# EAGLE design SA_v2a (EAGLE 7.5.0)
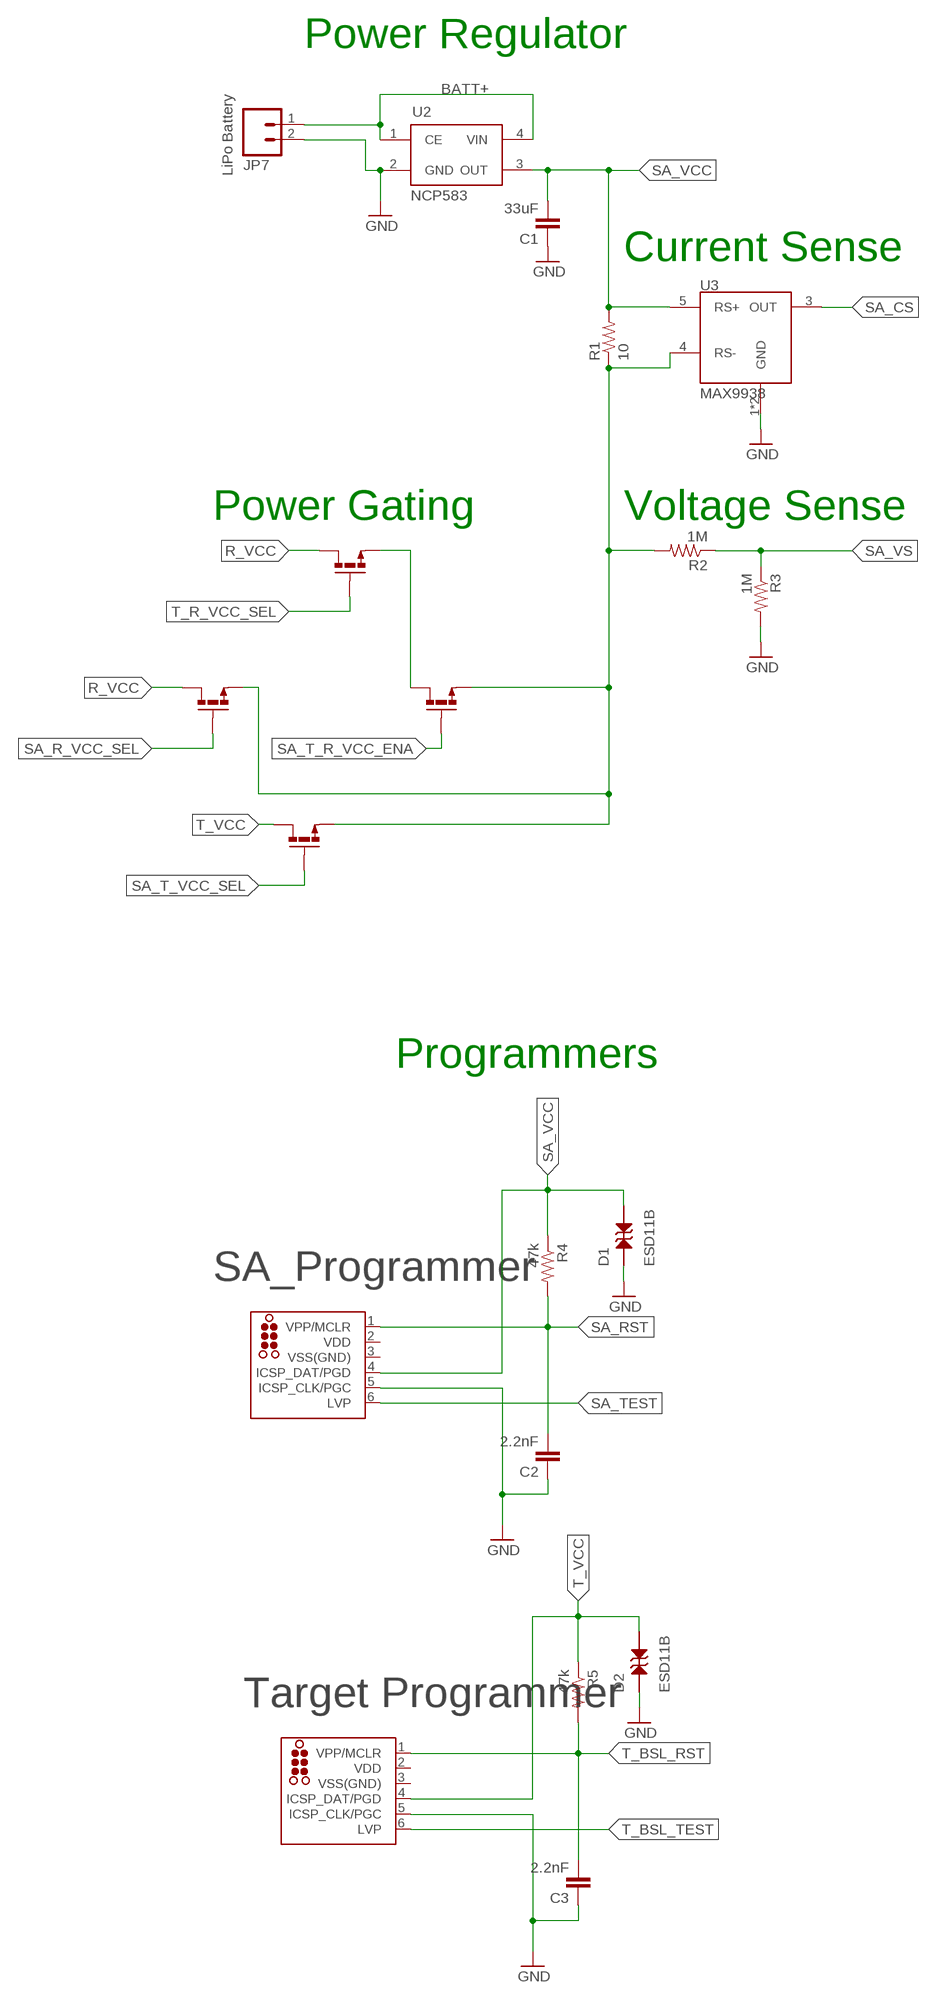
[diagram p0: schematic, sheet 1, part 1 of 2]
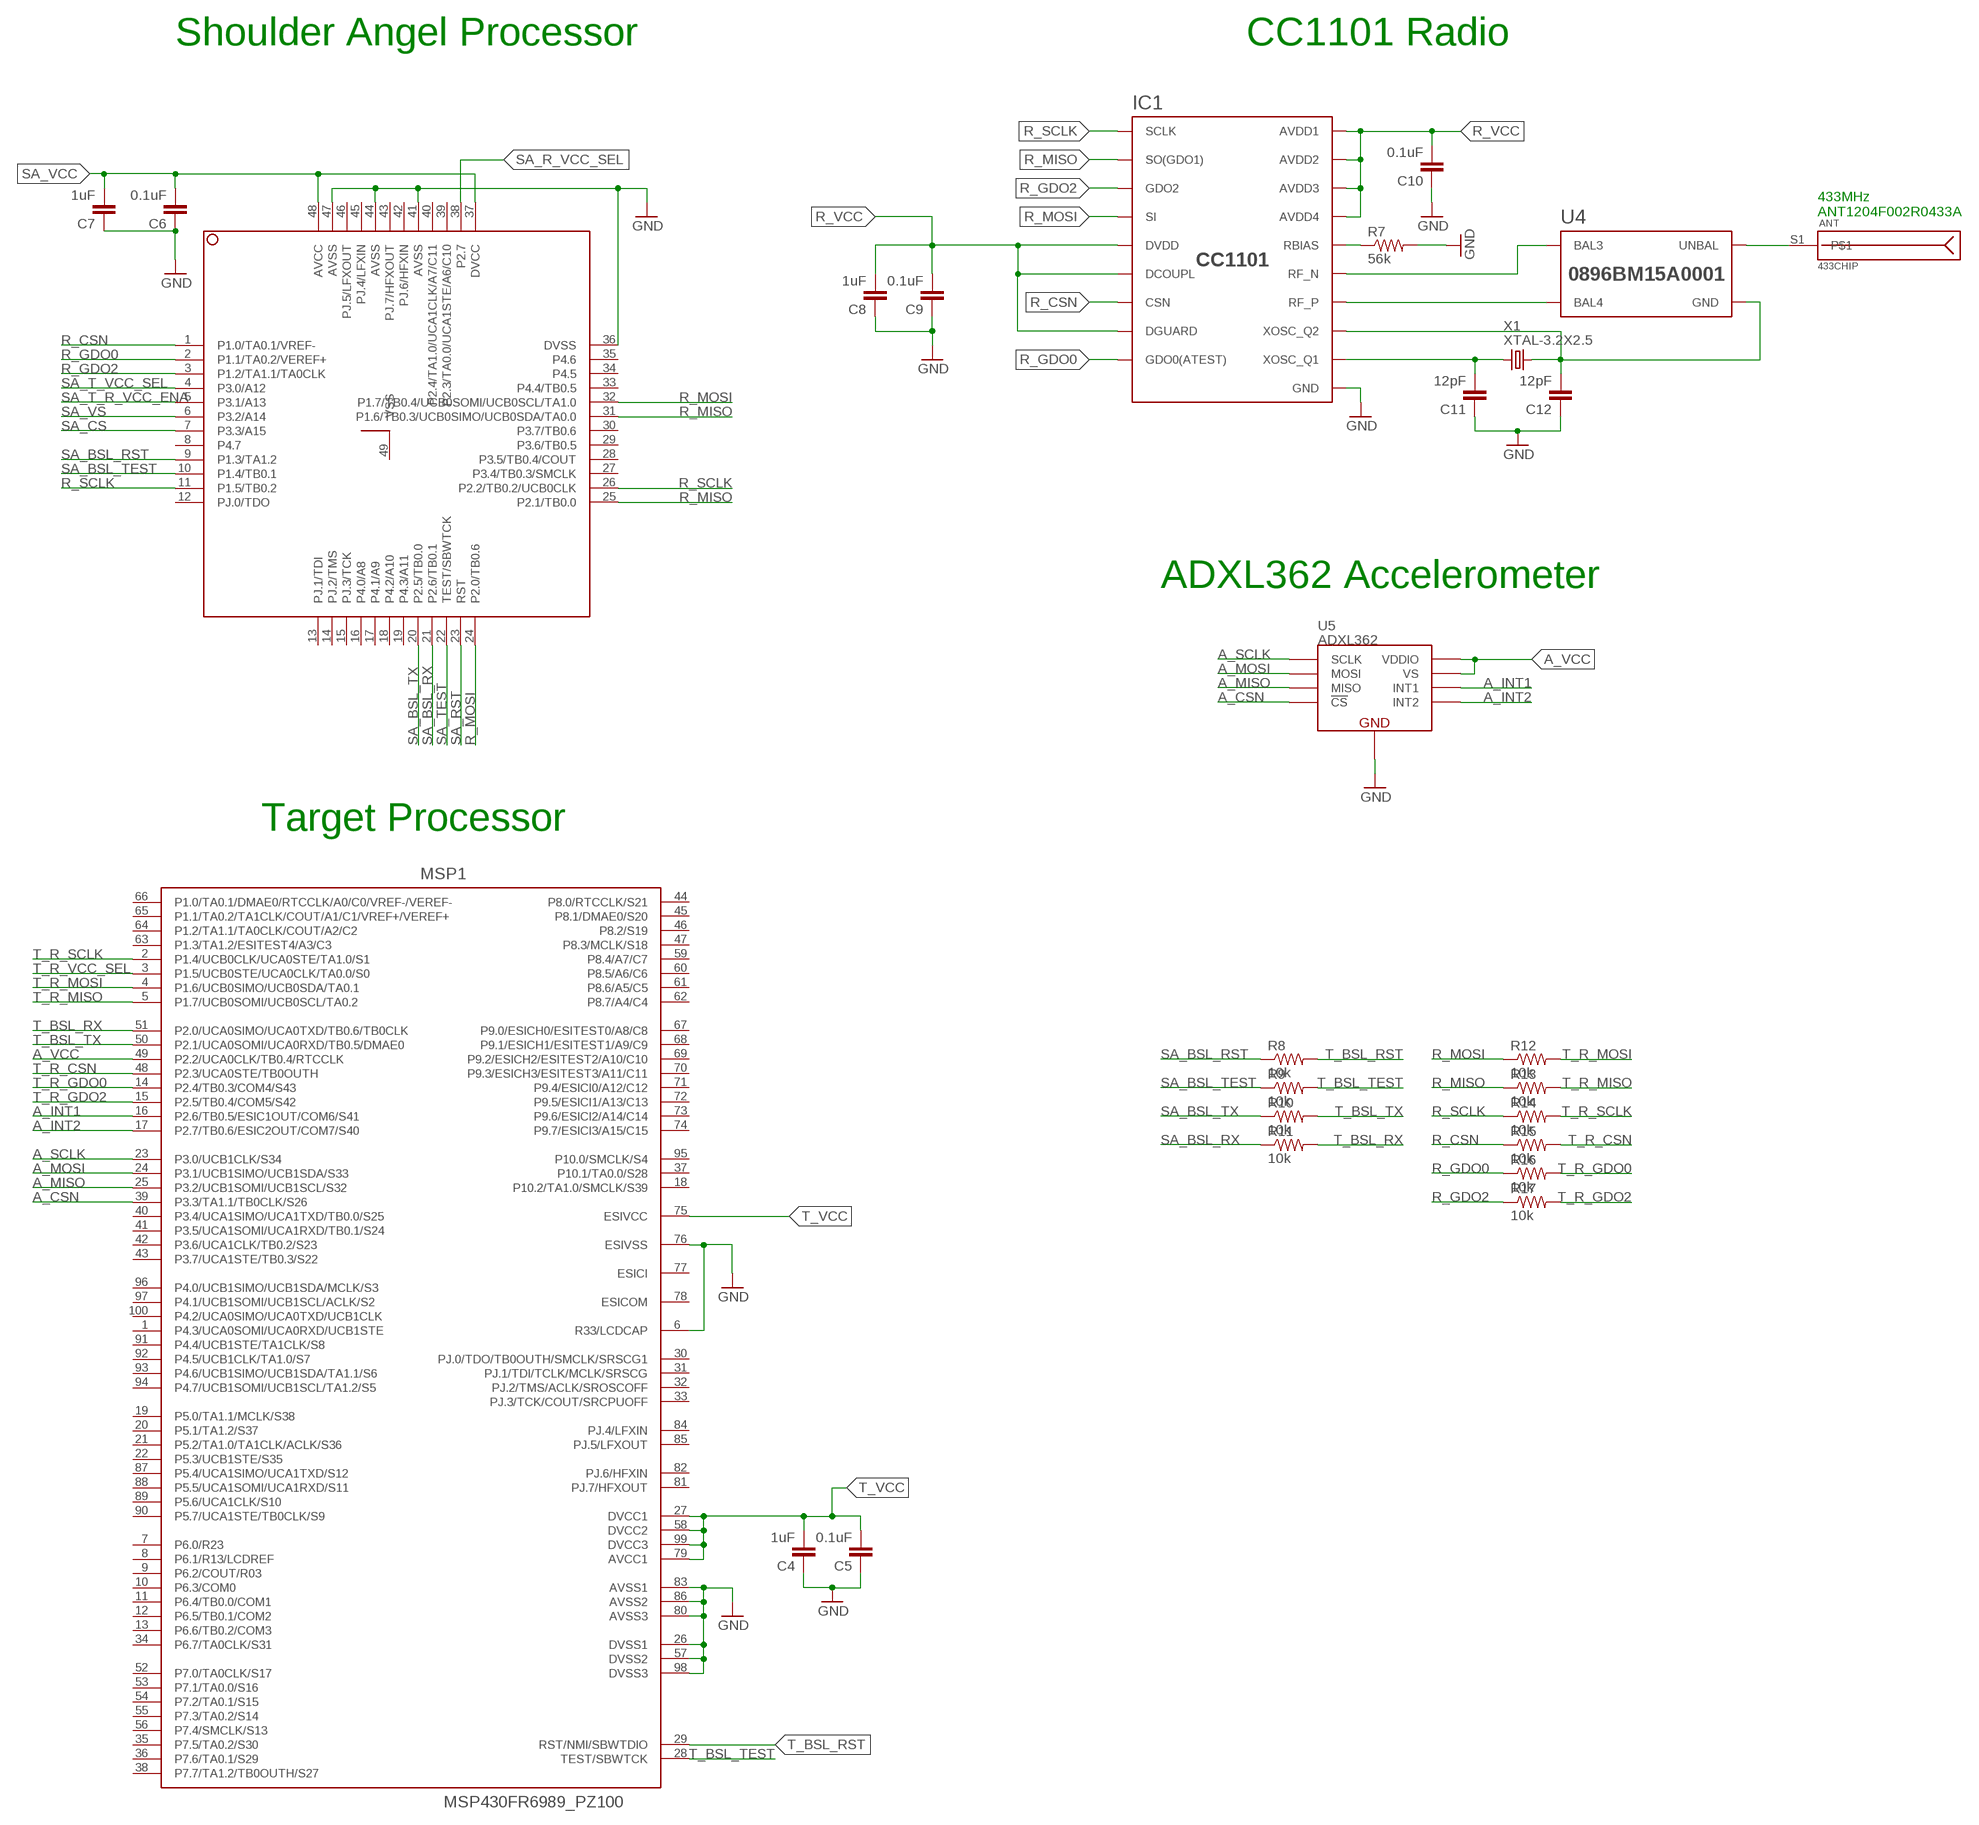
[diagram p1: schematic, sheet 1, part 2 of 2]

## Parts
ANT  433CHIP  [ANT-433-USP]
C1  33uF  CAP0805  [0805]
C2  2.2nF  C-EU  [0402]
C3  2.2nF  C-EU  [0402]
C4  1uF  C-EU  [0402]
C5  0.1uF  C-EU  [0402]
C6  0.1uF  C-EU  [0402]
C7  1uF  C-EU  [0402]
C8  1uF  C-EU  [0402]
C9  0.1uF  C-EU  [0402]
C10  0.1uF  C-EU  [0402]
C11  12pF  C-EU  [0402]
C12  12pF  C-EU  [0402]
D1  ESD11B  [DSN2]
D2  ESD11B  [DSN2]
IC1  CC1101  [QLP20]
J1  TC2030-MCP-NL  [TC2030-MCP-NL]
J2  TC2030-MCP-NL  [TC2030-MCP-NL]
JP7  LiPo Battery  M02-JST-2MM-SMT  [JST-2-SMD]
MSP1  MSP430FR6989_PZ100  [PZ100]
R1  10  R-EU  [0402]
R2  1M  R-EU  [0402]
R3  1M  R-EU  [0402]
R4  47k  R-EU  [0402]
R5  47k  R-EU  [0402]
R7  56k  R-EU  [0402]
R8  10k  R-EU  [0402]
R9  10k  R-EU  [0402]
R10  10k  R-EU  [0402]
R11  10k  R-EU  [0402]
R12  10k  R-EU  [0402]
R13  10k  R-EU  [0402]
R14  10k  R-EU  [0402]
R15  10k  R-EU  [0402]
R16  10k  R-EU  [0402]
R17  10k  R-EU  [0402]
U1  MSP430FR5969_RGZ_48  [RGZ48_4P1X4P1]
U2  NCP583  [SC82-AB_1PRIMARY]
U3  MAX9938  [SOT23-5]
U4  0896BM15A0001  [XXXXBM15A0001]
U5  ADXL362  [ADXL362]
U$1  FDG6303N  [SC70-6]
U$2  FDG6303N  [SC70-6]
X1  XTAL-3.2X2.5  [XTAL-3.2X2.5]

## Nets
A_CSN: MSP1.39(P3.3/TA1.1/TB0CLK/S26) U5.P$8(!CS)
A_INT1: MSP1.16(P2.6/TB0.5/ESIC1OUT/COM6/S41) U5.P$11(INT1)
A_INT2: MSP1.17(P2.7/TB0.6/ESIC2OUT/COM7/S40) U5.P$9(INT2)
A_MISO: MSP1.25(P3.2/UCB1SOMI/UCB1SCL/S32) U5.P$7(MISO)
A_MOSI: MSP1.24(P3.1/UCB1SIMO/UCB1SDA/S33) U5.P$6(MOSI)
A_SCLK: MSP1.23(P3.0/UCB1CLK/S34) U5.P$4(SCLK)
A_VCC: MSP1.49(P2.2/UCA0CLK/TB0.4/RTCCLK) U5.P$1(VDDIO) U5.P$14(VS)
BATT+: JP7.1 U2.1(CE) U2.4(VIN)
GND: C1.1 C2.1 C3.1 C4.1 C5.1 C6.1 C7.1 C8.1 C9.1 C10.1 C11.1 C12.1 D1.P$1 D2.P$1 IC1.16(GND) IC1.19(GND) IC1.GND IC1.GND1(GND) IC1.GND2(GND) IC1.GND3(GND) IC1.GND4(GND) IC1.GND5(GND) J1.5(ICSP_CLK/PGC) J2.5(ICSP_CLK/PGC) JP7.2 MSP1.6(R33/LCDCAP) MSP1.26(DVSS1) MSP1.57(DVSS2) MSP1.76(ESIVSS) MSP1.80(AVSS3) MSP1.83(AVSS1) MSP1.86(AVSS2) MSP1.98(DVSS3) R3.2 R7.2 U1.36(DVSS) U1.41(AVSS) U1.44(AVSS) U1.47(AVSS) U2.2(GND) U3.1(GND) U3.2(GND) U5.P$12(GND) U5.P$13(GND) U5.P$16(GND)
N$1: IC1.17(RBIAS) R7.1
N$2: IC1.12(RF_P) U4.4(BAL4)
N$3: R1.1 R2.2 U3.4(RS-) U$1.4(S1) U$2.1(S2) U$2.4(S1)
N$4: U$1.1(S2) U$1.3(D1)
N$5: IC1.13(RF_N) U4.3(BAL3)
N$6: C12.2 IC1.10(XOSC_Q2) U4.2(GND) U4.5(GND) U4.6(GND) X1.3
N$7: C11.2 IC1.8(XOSC_Q1) X1.1
N$9: ANT.S1 U4.1(UNBAL)
R_CSN: IC1.7(CSN) R15.1 U1.1(P1.0/TA0.1/VREF-)
R_GDO0: IC1.6(GDO0(ATEST)) R16.1 U1.2(P1.1/TA0.2/VEREF+)
R_GDO2: IC1.3(GDO2) R17.1 U1.3(P1.2/TA1.1/TA0CLK)
R_MISO: IC1.2(SO(GDO1)) R13.1 U1.25(P2.1/TB0.0) U1.31(P1.6/TB0.3/UCB0SIMO/UCB0SDA/TA0.0)
R_MOSI: IC1.20(SI) R12.1 U1.24(P2.0/TB0.6) U1.32(P1.7/TB0.4/UCB0SOMI/UCB0SCL/TA1.0)
R_SCLK: IC1.1(SCLK) R14.1 U1.11(P1.5/TB0.2) U1.26(P2.2/TB0.2/UCB0CLK)
R_VCC: C8.2 C9.2 C10.2 IC1.4(DVDD) IC1.5(DCOUPL) IC1.9(AVDD1) IC1.11(AVDD2) IC1.14(AVDD3) IC1.15(AVDD4) IC1.18(DGUARD) U$1.6(D2) U$2.6(D2)
SA_BSL_RST: R8.1 U1.9(P1.3/TA1.2)
SA_BSL_RX: R11.1 U1.21(P2.6/TB0.1)
SA_BSL_TEST: R9.1 U1.10(P1.4/TB0.1)
SA_BSL_TX: R10.1 U1.20(P2.5/TB0.0)
SA_CS: U1.7(P3.3/A15) U3.3(OUT)
SA_R_VCC_SEL: U1.38(P2.7) U$2.2(G2)
SA_RST: C2.2 J1.1(VPP/MCLR) R4.2 U1.23(RST)
SA_T_R_VCC_ENA: U1.5(P3.1/A13) U$1.5(G1)
SA_T_VCC_SEL: U1.4(P3.0/A12) U$2.5(G1)
SA_TEST: J1.6(LVP) U1.22(TEST/SBWTCK)
SA_VCC: C1.2 C6.2 C7.2 D1.P$2 J1.4(ICSP_DAT/PGD) R1.2 R4.1 U1.37(DVCC) U1.48(AVCC) U2.3(OUT) U3.5(RS+)
SA_VS: R2.1 R3.1 U1.6(P3.2/A14)
T_BSL_RST: C3.2 J2.1(VPP/MCLR) MSP1.29(RST/NMI/SBWTDIO) R5.2 R8.2
T_BSL_RX: MSP1.51(P2.0/UCA0SIMO/UCA0TXD/TB0.6/TB0CLK) R11.2
T_BSL_TEST: J2.6(LVP) MSP1.28(TEST/SBWTCK) R9.2
T_BSL_TX: MSP1.50(P2.1/UCA0SOMI/UCA0RXD/TB0.5/DMAE0) R10.2
T_R_CSN: MSP1.48(P2.3/UCA0STE/TB0OUTH) R15.2
T_R_GDO0: MSP1.14(P2.4/TB0.3/COM4/S43) R16.2
T_R_GDO2: MSP1.15(P2.5/TB0.4/COM5/S42) R17.2
T_R_MISO: MSP1.5(P1.7/UCB0SOMI/UCB0SCL/TA0.2) R13.2
T_R_MOSI: MSP1.4(P1.6/UCB0SIMO/UCB0SDA/TA0.1) R12.2
T_R_SCLK: MSP1.2(P1.4/UCB0CLK/UCA0STE/TA1.0/S1) R14.2
T_R_VCC_SEL: MSP1.3(P1.5/UCB0STE/UCA0CLK/TA0.0/S0) U$1.2(G2)
T_VCC: C4.2 C5.2 D2.P$2 J2.4(ICSP_DAT/PGD) MSP1.27(DVCC1) MSP1.58(DVCC2) MSP1.75(ESIVCC) MSP1.79(AVCC1) MSP1.99(DVCC3) R5.1 U$2.3(D1)
Unconnected: MSP1.1(P4.3/UCA0SOMI/UCA0RXD/UCB1STE) MSP1.7(P6.0/R23) MSP1.8(P6.1/R13/LCDREF) MSP1.9(P6.2/COUT/R03) MSP1.10(P6.3/COM0) MSP1.11(P6.4/TB0.0/COM1) MSP1.12(P6.5/TB0.1/COM2) MSP1.13(P6.6/TB0.2/COM3) MSP1.18(P10.2/TA1.0/SMCLK/S39) MSP1.19(P5.0/TA1.1/MCLK/S38) MSP1.20(P5.1/TA1.2/S37) MSP1.21(P5.2/TA1.0/TA1CLK/ACLK/S36) MSP1.22(P5.3/UCB1STE/S35) MSP1.30(PJ.0/TDO/TB0OUTH/SMCLK/SRSCG1) MSP1.31(PJ.1/TDI/TCLK/MCLK/SRSCG) MSP1.32(PJ.2/TMS/ACLK/SROSCOFF) MSP1.33(PJ.3/TCK/COUT/SRCPUOFF) MSP1.34(P6.7/TA0CLK/S31) MSP1.35(P7.5/TA0.2/S30) MSP1.36(P7.6/TA0.1/S29) MSP1.37(P10.1/TA0.0/S28) MSP1.38(P7.7/TA1.2/TB0OUTH/S27) MSP1.40(P3.4/UCA1SIMO/UCA1TXD/TB0.0/S25) MSP1.41(P3.5/UCA1SOMI/UCA1RXD/TB0.1/S24) MSP1.42(P3.6/UCA1CLK/TB0.2/S23) MSP1.43(P3.7/UCA1STE/TB0.3/S22) MSP1.44(P8.0/RTCCLK/S21) MSP1.45(P8.1/DMAE0/S20) MSP1.46(P8.2/S19) MSP1.47(P8.3/MCLK/S18) MSP1.52(P7.0/TA0CLK/S17) MSP1.53(P7.1/TA0.0/S16) MSP1.54(P7.2/TA0.1/S15) MSP1.55(P7.3/TA0.2/S14) MSP1.56(P7.4/SMCLK/S13) MSP1.59(P8.4/A7/C7) MSP1.60(P8.5/A6/C6) MSP1.61(P8.6/A5/C5) MSP1.62(P8.7/A4/C4) MSP1.63(P1.3/TA1.2/ESITEST4/A3/C3) MSP1.64(P1.2/TA1.1/TA0CLK/COUT/A2/C2) MSP1.65(P1.1/TA0.2/TA1CLK/COUT/A1/C1/VREF+/VEREF+) MSP1.66(P1.0/TA0.1/DMAE0/RTCCLK/A0/C0/VREF-/VEREF-) MSP1.67(P9.0/ESICH0/ESITEST0/A8/C8) MSP1.68(P9.1/ESICH1/ESITEST1/A9/C9) MSP1.69(P9.2/ESICH2/ESITEST2/A10/C10) MSP1.70(P9.3/ESICH3/ESITEST3/A11/C11) MSP1.71(P9.4/ESICI0/A12/C12) MSP1.72(P9.5/ESICI1/A13/C13) MSP1.73(P9.6/ESICI2/A14/C14) MSP1.74(P9.7/ESICI3/A15/C15) MSP1.77(ESICI) MSP1.78(ESICOM) MSP1.81(PJ.7/HFXOUT) MSP1.82(PJ.6/HFXIN) MSP1.84(PJ.4/LFXIN) MSP1.85(PJ.5/LFXOUT) MSP1.87(P5.4/UCA1SIMO/UCA1TXD/S12) MSP1.88(P5.5/UCA1SOMI/UCA1RXD/S11) MSP1.89(P5.6/UCA1CLK/S10) MSP1.90(P5.7/UCA1STE/TB0CLK/S9) MSP1.91(P4.4/UCB1STE/TA1CLK/S8) MSP1.92(P4.5/UCB1CLK/TA1.0/S7) MSP1.93(P4.6/UCB1SIMO/UCB1SDA/TA1.1/S6) MSP1.94(P4.7/UCB1SOMI/UCB1SCL/TA1.2/S5) MSP1.95(P10.0/SMCLK/S4) MSP1.96(P4.0/UCB1SIMO/UCB1SDA/MCLK/S3) MSP1.97(P4.1/UCB1SOMI/UCB1SCL/ACLK/S2) MSP1.100(P4.2/UCA0SIMO/UCA0TXD/UCB1CLK) U1.8(P4.7) U1.12(PJ.0/TDO) U1.13(PJ.1/TDI) U1.14(PJ.2/TMS) U1.15(PJ.3/TCK) U1.16(P4.0/A8) U1.17(P4.1/A9) U1.18(P4.2/A10) U1.19(P4.3/A11) U1.27(P3.4/TB0.3/SMCLK) U1.28(P3.5/TB0.4/COUT) U1.29(P3.6/TB0.5) U1.30(P3.7/TB0.6) U1.33(P4.4/TB0.5) U1.34(P4.5) U1.35(P4.6) U1.39(P2.3/TA0.0/UCA1STE/A6/C10) U1.40(P2.4/TA1.0/UCA1CLK/A7/C11) U1.42(PJ.6/HFXIN) U1.43(PJ.7/HFXOUT) U1.45(PJ.4/LFXIN) U1.46(PJ.5/LFXOUT) U1.49(VSS)

## Notes on the sheet
- Shoulder Angel Processor | CC1101 Radio
- Power Regulator
- 433MHz
  ANT1204F002R0433A
- Current Sense
- Power Gating | Voltage Sense
- ADXL362 Accelerometer
- Target Processor
- Programmers
- SA_Programmer
- Target Programmer

## Power pins joined to a net without a drawn wire
VDD: J1.2(VDD) J2.2(VDD)
VSS(GND): J1.3(VSS(GND)) J2.3(VSS(GND))

## Library data of the parts
ANT = HF-Bauteile:433CHIP; DIGIKEY: ANT-433-USP-ND; MOUSER: 712-ANT-433-USP
C1 = SparkFun-Capacitors:CAP: Capacitor Standard 0603 ceramic capacitor, and 0.1" leaded capacitor.; DIGIKEY: 445-5986-1-ND; MOUSER: 810-C2012X5R0J336M
C2 C3 = tiny_passives:C-EU; DIGIKEY: 311-1037-1-ND; MOUSER: 603-CC402KRX7R9BB222
C4 C7 C8 = tiny_passives:C-EU; DIGIKEY: 311-1439-1-ND; MOUSER: 603-CC402KRX5R6BB105
C5 C6 C9 C10 = tiny_passives:C-EU; DIGIKEY: 311-1338-1-ND; MOUSER: 603-CC402KRX7R7BB104
C11 C12 = tiny_passives:C-EU; DIGIKEY: 1276-1178-1-ND; MOUSER: 81-GJM1555C1HR12BB1D
D1 D2 = esd11b:ESD11B: Transient Voltage Suppressor, Micro Packaged diodes for ESD protection DSN Package Datasheet: http://www.onsemi.com/pub_link/Collateral/ESD11B-D.PDF; DIGIKEY: ESD11B5.0ST5GOSCT-ND; MOUSER: ESD11B5.0ST5G
IC1 = cc1101:CC1101; DIGIKEY: 296-35718-1-ND; MOUSER: 595-CC1101RGPR
J1 J2 = tag-connect_msp430:TC2030: TAG-CONNECT ICSP Connector Manufacturer: Tag-Connect <http://www.tag-connect.com> Cable for easy In-Circuit Serial Programming. Designed for Microchip ICD2, suitable for many others. Two variants - one "with legs" (for hands-free fit on PCB) and another "without legs" for quick programming. PAD Description 1 MCLR/Vpp 2 Vdd 3 GND 4 PGD (ISPDAT) 5 PGC (ISPCLK) 6 nc (used for LVP) ©2009 ROFA.cz - modified and updated by Robert Darlington ‹rdarlington@gmail.com›
JP7 = SparkFun:M02: Header 2 Standard 2-pin 0.1" header. Use with straight break away headers (SKU : PRT-00116), right angle break away headers (PRT-00553), swiss pins (PRT-00743), machine pins (PRT-00117), and female headers (PRT-00115). Molex polarized connector foot print use with SKU : PRT-08233 with associated crimp pins and housings.; DIGIKEY: 455-1749-1-ND; MOUSER: ???????
MSP1 = msp430:MSP430FR6989_PZ100; DIGIKEY: 296-38379-5-ND; MOUSER: 595-MSP430FR6989IPZ
R1 = tiny_passives:R-EU; DIGIKEY: YAG3340CT-ND; MOUSER: 603-RT0402BRD0710RL
R2 R3 = tiny_passives:R-EU; DIGIKEY: 311-1.00MLRCT-ND; MOUSER: 603-RC0402FR-071ML
R4 R5 = tiny_passives:R-EU; DIGIKEY: 311-47.0KLRCT-ND; MOUSER: 603-RC0402FR-0747KL
R7 = tiny_passives:R-EU; DIGIKEY: 311-56KJRCT-ND; MOUSER: 603-RC0402JR-0756KL
R8-R17 = tiny_passives:R-EU; DIGIKEY: 311-10KJRCT-ND; MOUSER: 603-RC0402JR-0710KL
U1 = msp430:MSP430FR5969_RGZ_48: MSP430FR59xx Mixed Signal Microcontroller Package: RGZ-S-PQVFN-N48 (MSP430FR596x and MSP430FR586x) Description The Texas Instruments MSP430FR58xx and MSP430FR59xx family of ultralow-power microcontrollers consists of several devices featuring embedded FRAM nonvolatile memory, an ultralow-power 16-bit MSP430 CPU, and different sets of peripherals targeted for various applications. The architecture, FRAM, and peripherals, combined with seven low-power modes, are optimized to achieve extended battery life in portable and wireless sensing applications. FRAM is a new nonvolatile memory that combines the speed, flexibility, and endurance of SRAM with the stability and reliability of flash, all at lower total power consumption.; DIGIKEY: 296-37875-1-ND; MANUFACTURER_PART_NUMBER: msp430fr5969_rgz_48; MOUSER: 595-SP430FR5969IRGZR; VENDOR: Texas Instruments
U2 = ncp583:NCP583: NCP583 - Ultra-Low Iq 150 mA CMOS LDO Regulator with Enable The NCP583 series of low dropout regulators are designed for portable battery powered applications which require precise output voltage accuracy and low quiescent current. These devices feature an enable function which lowers current consumption significantly and are offered in two small packages; SC−82AB and the SOT−563. A 1.0 mF ceramic capacitor is the recommended value to be used with these devices on the output pin.; DIGIKEY: NCP583SQ33T1GOSCT-ND; MOUSER: 863-NCP583SQ33T1G
U3 = max9938:MAX9938: 1μA, 4-Bump UCSP/SOT23, Precision Current-Sense Amplifier The MAX9938 high-side current-sense amplifier offers precision accuracy specifications of VOS less than 500μV (max) and gain error less than 0.5% (max). Quiescent supply current is an ultra-low 1μA. The MAX9938 fits in a tiny, 1mm x 1mm UCSPTM package size or a 5-pin SOT23 package, making the part ideal for applications in notebook computers, cell phones, PDAs, and all battery-operated portable devices where accura- cy, low quiescent current, and small size are critical. The MAX9938 features an input common-mode voltage range from 1.6V to 28V. These current-sense amplifiers have a voltage output and are offered in four gain versions: 25V/V (MAX9938T), 50V/V (MAX9938F), 100V/V (MAX9938H), and 200V/V (MAX9938W). The four gain selections offer flexibility in the choice of the external current-sense resistor. The very low 500μV (max) input offset voltage allows small 25mV to 50mV full-scale VSENSE voltage for very low voltage drop at full-current measurement. The MAX9938 is offered in tiny 4-bump, UCSP (1mm x 1mm x 0.6mm footprint), 5-pin SOT23, and 6-pin μDFN (2mm x 2mm x 0.8mm) packages specified for operation over the -40°C to +85°C extended temperature range.; DIGIKEY: MAX9938WEUK+TCT-ND; MOUSER: 700-MAX9938WEUK+T
U4 = johanson-baluns:0896BM15A0001: 868/915 MHz Impedance Matched/Balun/LPF Integrated Component for T.I. CC110X, CC111X, CC113X and CC115X, CC110L, CC113L, CC115L, CC430 and RF430; DIGIKEY: 712-1474-1-ND; MOUSER: 609-0896BM15A0001E
U5 = adxl362:ADXL362: Micropower 3-axis accelerometer 2/4/8g digital output (SPI); DIGIKEY: ADXL362BCCZ-RL7CT-ND; MOUSER: 584-ADXL362BCCZ-R7
U$1 U$2 = fdg6303n:FDG6303N: FDG6303N Dual N-Channel, Digital FET These dual N-Channel logic level enhancement mode field effect transistors are produced using Fairchild's proprietary, high cell density, DMOS technology. This very high density process is especially tailored to minimize on-state resistance. This device has been designed especially for low voltage applications as a replacement for bipolar digital transistors and small signal MOSFETs.; DIGIKEY: FDG6303NCT-ND; MOUSER: 512-FDG6303N
X1 = cc1101:XTAL; DIGIKEY: 644-1261-1-ND; MOUSER: ??????

## Board
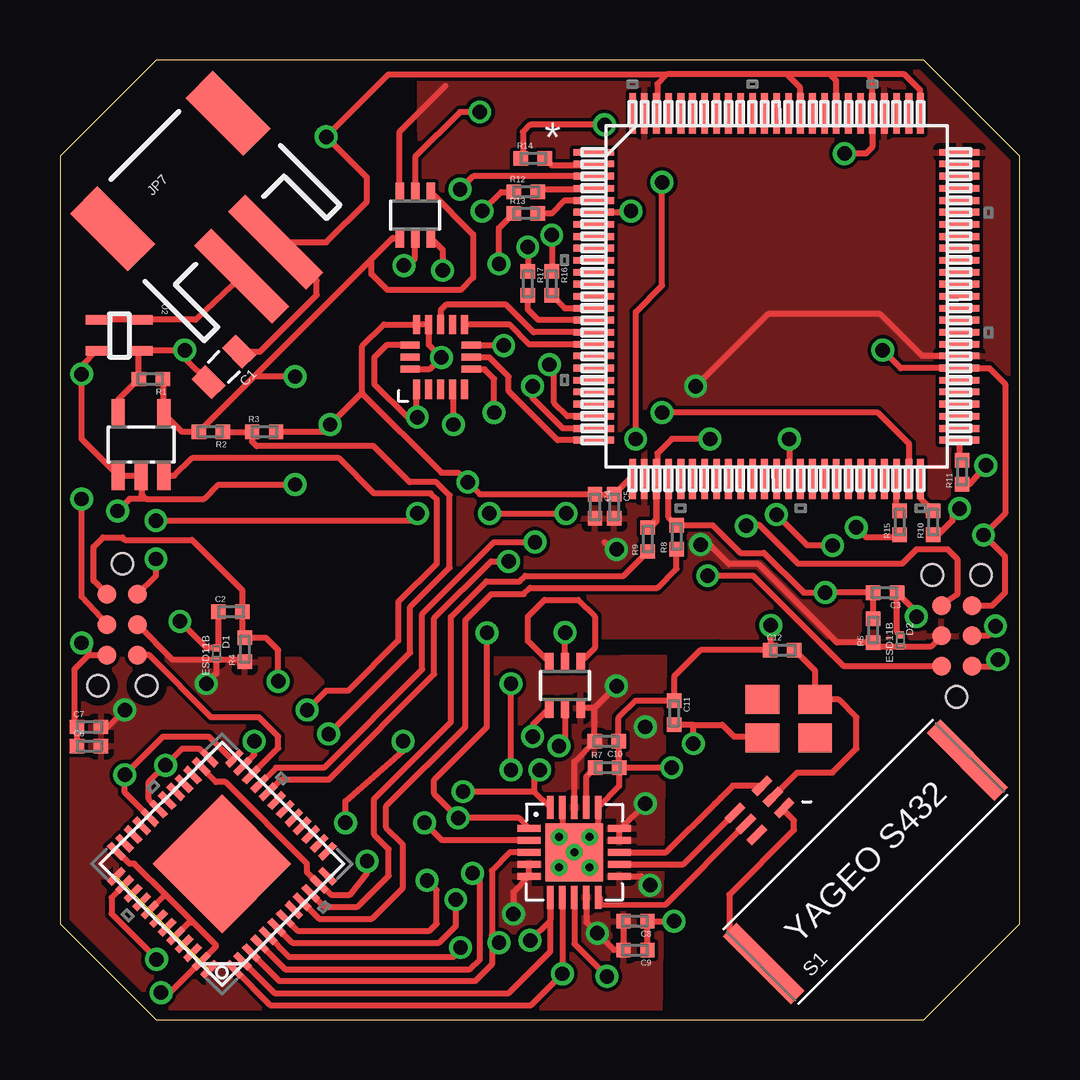
[diagram p2: board, top side]
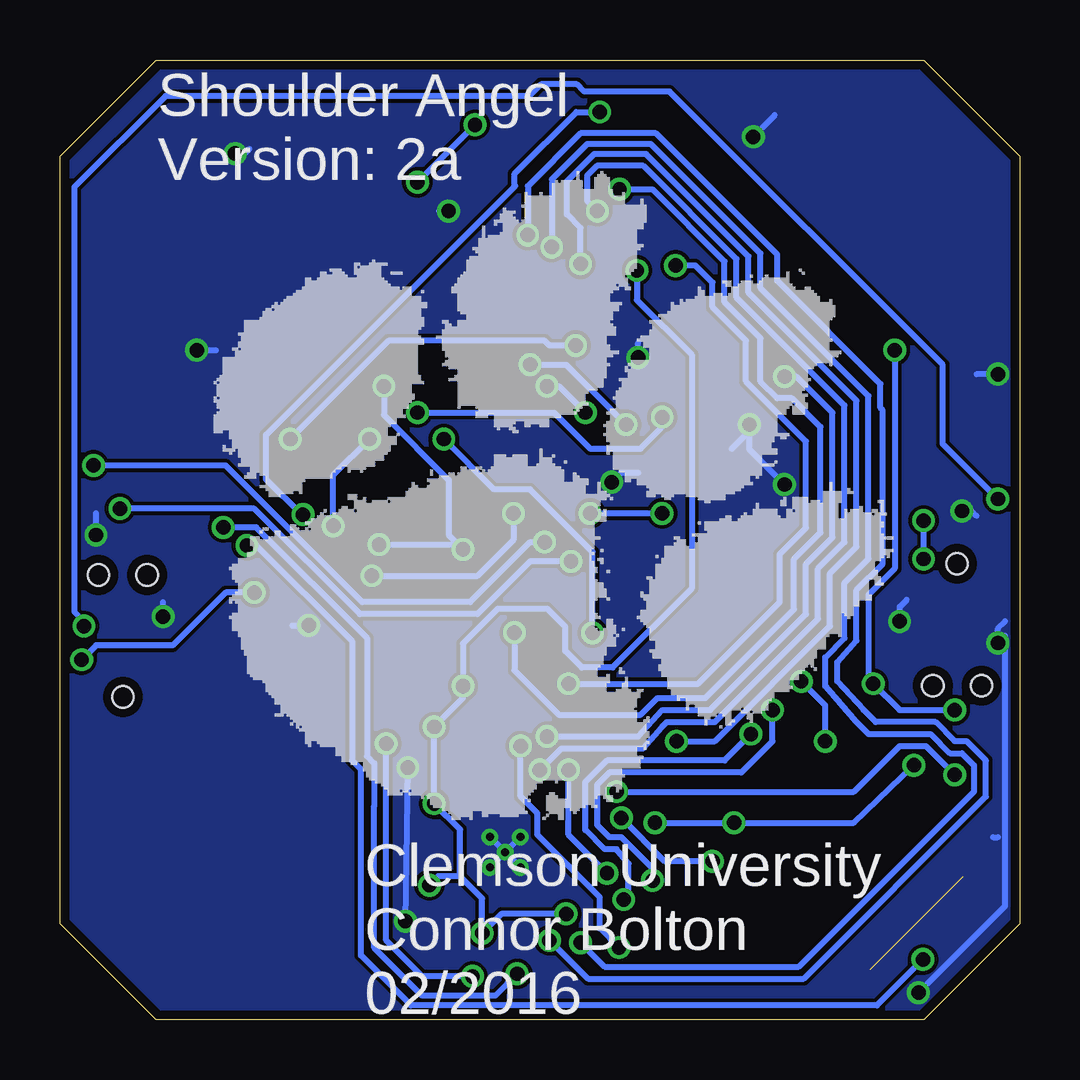
[diagram p3: board, bottom side, seen from below]

Size 40 x 40 mm. Coordinates in mm from the lower left corner, seen from the top.
Outline: 4,0 36,0 40,4 40,36 36,40 4,40 0,36 0,4 4,0
Copper layers (1*16): Top 0.0356mm / dielectric 1.5011mm / Bottom 0.0356mm
Design rules "LaenPCBOrder": minimum track width 6mil, minimum drill 13mil, track to track 6mil, track to pad 6mil, pad to pad 6mil, via to via 6mil, smd to smd 6mil, copper to edge 15mil, drill to drill 6mil, minimum pad ring 7mil, minimum via ring 7mil, stop-mask expansion 3mil, vias tented up to drill 0mil, thermal gap 10mil

### Footprints (pad centres in the part's own frame; a part is rotated, then mirrored left to right if it is on the bottom)
ANT-433-USP = smd 0.8 x 4: P$4 6,0; S1 -6,0
0805 = smd 0.8 x 1.2: 1 -0.9,0; 2 0.9,0
0402 = smd 0.6 x 0.6: 1 -0.49,0; 2 0.51,0
DSN2 = smd 0.28 x 0.3: P$1 -0.24,0; P$2 0.23,0
QLP20 = smd 0.96 x 0.28: 1 -1.88,1; 2 -1.88,0.5; 3 -1.88,0; 4 -1.88,-0.5; 5 -1.88,-1; 11 1.88,-1; 12 1.88,-0.5; 13 1.88,0; 14 1.88,0.5; 15 1.88,1 | smd 0.28 x 0.96: 6 -1,-1.88; 7 -0.5,-1.88; 8 0,-1.88; 9 0.5,-1.88; 10 1,-1.88; 16 1,1.88; 17 0.5,1.88; 18 0,1.88; 19 -0.5,1.88; 20 -1,1.88 | smd 2.4 x 2.4: GND 0,0 | drill 0.333: GND1 0,0; GND2 -0.635,0.635; GND3 0.635,0.635; GND4 -0.635,-0.635; GND5 0.635,-0.635
TC2030-MCP-NL = smd 0.787 x 0.787: 1 1.27,-0.635; 2 1.27,0.635; 3 2.54,-0.635; 4 2.54,0.635; 5 3.81,-0.635; 6 3.81,0.635 | hole 0.889: 0,0; 5.08,-1.016; 5.08,1.016
JST-2-SMD = smd 1 x 4.6: 1 -1,-3.7; 2 1,-3.7 | smd 1.6 x 3.4: NC1 -3.4,1.5; NC2 3.4,1.5
PZ100 = smd 1.676 x 0.279: 1 -7.62,5.994; 2 -7.62,5.512; 3 -7.62,5.004; 4 -7.62,4.496; 5 -7.62,3.988; 6 -7.62,3.505; 7 -7.62,2.997; 8 -7.62,2.489; 9 -7.62,2.007; 10 -7.62,1.499; 11 -7.62,0.991; 12 -7.62,0.508; 13 -7.62,0; 14 -7.62,-0.508; 15 -7.62,-0.991; 16 -7.62,-1.499; 17 -7.62,-2.007; 18 -7.62,-2.489; 19 -7.62,-2.997; 20 -7.62,-3.505; 21 -7.62,-3.988; 22 -7.62,-4.496; 23 -7.62,-5.004; 24 -7.62,-5.512; 25 -7.62,-5.994; 51 7.62,-5.994; 52 7.62,-5.512; 53 7.62,-5.004; 54 7.62,-4.496; 55 7.62,-3.988; 56 7.62,-3.505; 57 7.62,-2.997; 58 7.62,-2.489; 59 7.62,-2.007; 60 7.62,-1.499; 61 7.62,-0.991; 62 7.62,-0.508; 63 7.62,0; 64 7.62,0.508; 65 7.62,0.991; 66 7.62,1.499; 67 7.62,2.007; 68 7.62,2.489; 69 7.62,2.997; 70 7.62,3.505; 71 7.62,3.988; 72 7.62,4.496; 73 7.62,5.004; 74 7.62,5.512; 75 7.62,5.994 | smd 0.279 x 1.676: 26 -5.994,-7.62; 27 -5.512,-7.62; 28 -5.004,-7.62; 29 -4.496,-7.62; 30 -3.988,-7.62; 31 -3.505,-7.62; 32 -2.997,-7.62; 33 -2.489,-7.62; 34 -2.007,-7.62; 35 -1.499,-7.62; 36 -0.991,-7.62; 37 -0.508,-7.62; 38 0,-7.62; 39 0.508,-7.62; 40 0.991,-7.62; 41 1.499,-7.62; 42 2.007,-7.62; 43 2.489,-7.62; 44 2.997,-7.62; 45 3.505,-7.62; 46 3.988,-7.62; 47 4.496,-7.62; 48 5.004,-7.62; 49 5.512,-7.62; 50 5.994,-7.62; 76 5.994,7.62; 77 5.512,7.62; 78 5.004,7.62; 79 4.496,7.62; 80 3.988,7.62; 81 3.505,7.62; 82 2.997,7.62; 83 2.489,7.62; 84 2.007,7.62; 85 1.499,7.62; 86 0.991,7.62; 87 0.508,7.62; 88 0,7.62; 89 -0.508,7.62; 90 -0.991,7.62; 91 -1.499,7.62; 92 -2.007,7.62; 93 -2.489,7.62; 94 -2.997,7.62; 95 -3.505,7.62; 96 -3.988,7.62; 97 -4.496,7.62; 98 -5.004,7.62; 99 -5.512,7.62; 100 -5.994,7.62
RGZ48_4P1X4P1 = smd 0.838 x 0.279: 1 -3.48,2.743; 2 -3.48,2.261; 3 -3.48,1.753; 4 -3.48,1.245; 5 -3.48,0.762; 6 -3.48,0.254; 7 -3.48,-0.254; 8 -3.48,-0.762; 9 -3.48,-1.245; 10 -3.48,-1.753; 11 -3.48,-2.261; 12 -3.48,-2.743; 25 3.48,-2.743; 26 3.48,-2.261; 27 3.48,-1.753; 28 3.48,-1.245; 29 3.48,-0.762; 30 3.48,-0.254; 31 3.48,0.254; 32 3.48,0.762; 33 3.48,1.245; 34 3.48,1.753; 35 3.48,2.261; 36 3.48,2.743 | smd 0.279 x 0.838: 13 -2.743,-3.48; 14 -2.261,-3.48; 15 -1.753,-3.48; 16 -1.245,-3.48; 17 -0.762,-3.48; 18 -0.254,-3.48; 19 0.254,-3.48; 20 0.762,-3.48; 21 1.245,-3.48; 22 1.753,-3.48; 23 2.261,-3.48; 24 2.743,-3.48; 37 2.743,3.48; 38 2.261,3.48; 39 1.753,3.48; 40 1.245,3.48; 41 0.762,3.48; 42 0.254,3.48; 43 -0.254,3.48; 44 -0.762,3.48; 45 -1.245,3.48; 46 -1.753,3.48; 47 -2.261,3.48; 48 -2.743,3.48 | smd 4.089 x 4.089: 49 0,0
SC82-AB_1PRIMARY = smd 0.406 x 0.914: 1 -1.321,-0.813; 2 -0.025,-0.813; 3 -0.025,1.067; 4 -1.321,1.067
SOT23-5 = smd 0.55 x 1.2: 1 -0.95,-1.3; 2 0,-1.3; 3 0.95,-1.3; 4 0.95,1.3; 5 -0.95,1.3
XXXXBM15A0001 = smd 0.33 x 0.9: 1 0.65,0.8; 2 0,0.8; 3 -0.65,0.8; 4 -0.65,-0.8; 5 0,-0.8; 6 0.65,-0.8
ADXL362 = smd 0.8 x 0.3: P$1 -1.35,1; P$2 -1.35,0.5; P$3 -1.35,0; P$4 -1.35,-0.5; P$5 -1.35,-1; P$9 1.35,-1; P$10 1.35,-0.5; P$11 1.35,0; P$12 1.35,0.5; P$13 1.35,1 | smd 0.3 x 0.8: P$6 -0.5,-1.275; P$7 0,-1.275; P$8 0.5,-1.275; P$14 0.5,1.275; P$15 0,1.275; P$16 -0.5,1.275
SC70-6 = smd 0.35 x 0.8: 1 -0.65,-0.95; 2 0,-0.95; 3 0.65,-0.95; 4 0.65,0.95; 5 0,0.95; 6 -0.65,0.95
XTAL-3.2X2.5 = smd 1.4 x 1.2: 1 -1.1,-0.8; 2 1.1,-0.8; 3 1.1,0.8; 4 -1.1,0.8

### Placement (x,y rotation side)
ANT  33.58,6.57 45 top
C1  6.83,27.2 225 top
C2  7.1,17 0 top
C3  34.4,17.8 180 top
C4  22.3,21.4 270 top
C5  23.1,21.4 270 top
C6  1.2,11.4 0 top
C7  1.2,12.2 0 top
C8  24,4.1 180 top
C9  24,2.9 180 top
C10  22.8,11.6 180 top
C11  25.6,12.8 270 top
C12  30.1,15.4 0 top
D1  6.52,15.25 270 top
D2  35.02,15.79 270 top
IC1  21.44,6.97 0 top
J1  2.6,19 270 top
J2  37.38,13.45 90 top
JP7  5.66,34.31 45 top
MSP1  29.87,30.15 0 top
R1  3.8,26.7 180 top
R2  6.3,24.5 180 top
R3  8.5,24.5 0 top
R4  7.7,15.4 90 top
R5  33.9,16.2 90 top
R7  22.8,10.5 0 top
R8  25.7,20.1 90 top
R9  24.5,20 90 top
R10  36.4,20.7 90 top
R11  37.6,22.8 90 top
R12  19.4,34.5 0 top
R13  19.4,33.6 0 top
R14  19.7,35.9 0 top
R15  35,20.7 90 top
R16  20.5,30.7 270 top
R17  19.5,30.7 270 top
U1  6.75,6.49 135 top
U2  2.35,27.85 270 top
U3  3.38,23.97 0 top
U4  29.16,8.72 315 top
U5  15.87,27.62 90 top
U$1  21.05,13.93 180 top
U$2  14.81,33.53 180 top
X1  30.38,12.54 0 top

### Tracks (layer width: path | path; a pad name or v marks a point on that pad's centre or on a via)
A_CSN  (via drill 0.6 pad 0.25)
  Top 0.254: v30.4,24.2 30.4,22.55 MSP1.39 | U5.P$8 18.48,28.12 v18.5,28.1
  Bottom 0.254: v30.4,24.2 26.3,28.3 19.8,28.3 19.6,28.1 v18.5,28.1
A_INT1
  Top 0.254: MSP1.16 19.75,28.65 18.6,29.8 16.1,29.8 15.87,29.57 U5.P$11
A_INT2
  Top 0.254: MSP1.17 19.56,28.14 18.73,28.97 U5.P$9
A_MISO
  Top 0.254: MSP1.25 20.74,24.16 18.7,26.2 18.7,26.8 17.9,27.6 17.16,27.6 U5.P$7
A_MOSI  (via drill 0.6 pad 0.25)
  Top 0.254: MSP1.24 20.96,24.64 19.7,25.9 v19.7,26.4 | v18.1,25.3 18.1,26.7 17.7,27.1 17.16,27.1 U5.P$6
  Bottom 0.254: v19.7,26.4 19.2,26.4 v18.1,25.3
A_SCLK  (via drill 0.6 pad 0.25)
  Top 0.254: MSP1.23 21.15,25.15 20.6,25.7 20.6,27.1 v20.4,27.3 | v16.4,24.8 16.4,26.24 U5.P$4
  Bottom 0.254: v20.4,27.3 18.9,27.3 v16.4,24.8
A_VCC  (via drill 0.6 pad 0.25)
  Top 0.254: MSP1.49 35.4,22.55 35.4,24 34.1,25.3 v25.1,25.3 | 14.9,26.24 U5.P$1 14.87,25.14 v14.9,25.11 14.49,25.11 13.1,26.5 13.1,27.6 13.62,28.12 U5.P$14
  Bottom 0.254: v25.1,25.3 19.4,25.3 17.9,23.8 15.8,23.8 14.9,24.7 v14.9,25.11
BATT+
  Top 0.254: JP7.1 5.65,29.17 U2.4 U2.1
GND  (via drill 0.6 pad 0.25, 0.6 pad 0.3)
  Top 0.254: U2.2 0.9,27.24 v0.9,26.9 0.9,24.2 U3.1 U3.2 3.4,22.65 3.4,21.9 3.6,21.7 | 5.55,4.05 6.5,3.1 6.5,3.04 U1.47 4.58,1.12 v4.22,1.12 | 5.55,4.05 4.45,5.15 | 4.45,5.15 3.1,6.5 2.9,6.5 2.39,7.01 U1.36 | U1.41 4.33,5.15 4.45,5.15 | U1.44 5.39,4.05 5.55,4.05 | MSP1.76 35.86,38.74 35.2,39.4 33.7,39.4 | 33.7,39.4 32.1,39.4 | 32.1,39.4 30.3,39.4 | 30.3,39.4 25.3,39.4 | 25.3,39.4 24.9,39 24.9,37.8 MSP1.98 | 33.7,39.4 33.86,39.14 MSP1.80 33.86,36.36 33.6,36.1 v32.7,36.1 | MSP1.83 32.36,39.14 32.1,39.4 | MSP1.86 30.86,38.84 30.3,39.4 | MSP1.6 23.75,33.66 v23.8,33.7 | v34.3,27.9 35.05,27.15 MSP1.57 38.75,27.15 39.4,26.5 39.4,21.1 v38.5,20.2 39.4,19.3 39.4,17.8 38.86,17.26 J2.5 | IC1.19 20.94,7.74 IC1.GND2 | IC1.GND3 22.44,7.97 IC1.16 23.31,9.72 R7.2 | MSP1.26 23.74,22.53 C5.1 C4.1 17.51,21.89 v17,22.4 16.6,22.8 15.9,22.8 12.6,26.1 12.6,26.14 | D2.P$1 34.89,16.16 C3.1 35.7,16.99 v35.7,16.8 | 3.6,21.7 6,21.7 6.6,22.3 v9.8,22.3 | C2.1 6.61,15.58 D1.P$1 6.11,15.49 v5,16.6 | 3.6,21.7 2.9,21.7 v2.4,21.2 | 1.2,15.2 1.96,15.2 J1.5 | 1.2,15.2 0.6,14.6 0.6,12.31 C7.1 | 0.6,12.2 C7.1 | C6.1 C7.1 | 1.2,15.2 1.2,15.4 v0.9,15.7 | C9.1 C8.1 v25.6,4.1 | R7.2 23.31,11.58 C10.1 23.29,12.59 24,13.3 C11.1 25.6,14.3 26.7,15.4 C12.1 29.63,15.42 v29.63,16.43 | v25.5,10.5 R7.2 | U5.P$16 15.42,27.12 v15.9,27.6 15.37,28.13 U5.P$12 U5.P$13 13.5,28.97 12.6,28.07 12.6,26.14 | R3.2 10.96,24.5 v11.26,24.8 12.6,26.14 | C1.1 8.34,27.84 10.7,30.2 10.7,30.8 10.4,31.1 10.28,31.1 JP7.2 11.1,32.4 12.8,34.1 12.8,35.1 v11.1,36.8 13.7,39.4 25.3,39.4
  Bottom 0.254: v0.9,26.9 1.8,26.9 | v23.8,33.7 24.2,33.7 | v32.7,36.1 32.3,36.1 32.1,36.3 | v34.3,27.9 33.5,27.9 | IC1.GND1 IC1.GND4 | IC1.GND1 IC1.GND2 | IC1.GND1 21.47,6.97 21.5,7 21.5,7.03 IC1.GND3 | IC1.GND5 IC1.GND1 | v38.5,20.2 38.5,21.1 | v11.1,36.8 10.2,37.7 | v17,22.4 16.6,22.8 15.9,22.8 | v35.7,16.8 35.7,17.4 | 12,23.8 11.3,24.5 v11.26,24.8 11.26,23.76 v9.8,22.3 | v5,16.6 5,17.2 4.7,17.5 | v2.4,21.2 2,21.2 1.8,21 | 1.1,7.6 0.9,7.6 | 0.6,16.6 0.9,16.3 v0.9,15.7 0.6,16 0.6,4.73 v4.22,1.12 | v25.6,4.1 v25.5,10.5 | v15.9,27.6 15.9,28.2 | v29.63,16.43 29.65,16.41 30.3,16.41
  pour Bottom: 0,36.07 3.94,40.01 35.94,40.01 40.01,35.94 40.01,4.06 35.94,0 4.06,0 0,4.06
N$1
  Top 0.254: IC1.17 21.94,10.13 R7.1
N$2
  Top 0.254: IC1.12 25.99,6.47 U4.4
N$3  (via drill 0.6 pad 0.25)
  Top 0.254: U$1.4 19.7,12.28 v19.7,11.8 | v9.8,26.8 8.09,26.8 R2.2 | R2.2 12.98,31.69 | 12.98,31.69 13.87,32.58 U$2.4 | 4.23,26.64 R1.1 4.33,26.66 U3.4 5.1,24.5 R2.2 | U$2.1 17.22,32.72 17.22,30.92 16.71,30.42 13.65,30.42 13,31.07 12.98,31.07 12.98,31.69
  Bottom 0.254: v19.7,11.8 15.9,11.8 14.9,12.9 12.9,12.9 8.9,16.9 8.9,19 7.8,20.1 7.8,25.3 9.3,26.8 v9.8,26.8
N$4
  Top 0.254: U$1.3 19.5,15.78 19.5,16.8 20.2,17.5 21.6,17.5 22.3,16.8 22.3,15.48 U$1.1
N$5
  Top 0.254: IC1.13 25.27,6.97 27.3,9 27.55,9.24 28.05,9.74 U4.3
N$6
  Top 0.254: 30.68,15.33 C12.2 31.48,14.53 X1.3 32.46,13.34 33.2,12.6 33.2,11.3 32.2,10.3 30.74,10.3 U4.2 | IC1.10 22.5,5.09 22.5,4.8 25.23,4.79 U4.5
N$7  (via drill 0.6 pad 0.25)
  Top 0.254: 26.4,12.29 C11.2 | IC1.8 21.44,3.16 v22.8,1.8 | v26.4,11.5 26.4,12.29 | 26.4,12.29 27.61,12.29 28.1,11.8 29.22,11.8 X1.1
  Bottom 0.254: v22.8,1.8 24.9,1.8 26.4,3.3 v26.4,11.5
N$9
  Top 0.254: ANT.S1 27.9,3.77 27.9,5.2 30.6,7.9 30.6,8.3 30.18,8.71 U4.1
R_CSN  (via drill 0.6 pad 0.25, 0.6 pad 0.3)
  Top 0.254: U1.1 8.76,0.6 19.64,0.6 v20.94,1.91 IC1.7 | R15.1 34.89,20.1 33.61,20.1 v33.19,20.52
  Bottom 0.254: v20.94,1.91 21.85,1 24.9,1 26.9,3 26.9,8.9 26.9,10.68 27.2,10.98 27.2,15.9 31.82,20.52 v33.19,20.52
R_GDO0  (via drill 0.6 pad 0.25)
  Top 0.254: U1.2 8.94,1.1 18.7,1.1 20.44,2.84 IC1.6 20.44,4.14 v19.6,3.3 | v20.5,32.7 R16.1
  Bottom 0.254: v19.6,3.3 18,1.7 9,1.7 1.4,9.3 1.4,10.8 2.2,11.6 2.7,11.6 3.5,12.4 6,12.4 6.5,12.9 7.6,14.1 7.6,14.9 6.8,15.8 6.8,17.9 5.7,19 5.7,25.4 5.8,25.5 5.8,26.5 10.1,30.8 10.1,31.89 15.15,36.94 18.3,36.94 20.5,34.74 v20.5,32.7
R_GDO2  (via drill 0.6 pad 0.25)
  Top 0.254: U1.3 9.16,1.6 17.3,1.6 18,2.3 18,3.5 | IC1.3 18.77,6.97 18,6.2 18,3.5 | 18,3.5 v18.3,3.2 | v19.5,32.2 R17.1
  Bottom 0.254: v18.3,3.2 17.3,2.2 9.2,2.2 1.9,9.5 1.9,10.6 2.4,11.1 2.9,11.1 3.7,11.9 6.3,11.9 6.8,12.4 8.1,13.9 8.1,15.1 7.3,15.9 7.3,18.2 6.3,19.2 6.3,26 10.8,30.5 10.8,31.93 15.37,36.5 18.02,36.5 19.49,35.03 v19.49,32.21 v19.5,32.2
R_MISO  (via drill 0.6 pad 0.25)
  Top 0.254: IC1.2 15.93,7.47 v15.2,8.2 | U1.25 6.21,10.89 5.8,11.3 5.1,11.3 v4.4,10.6 3.7,9.9 3.7,9.18 U1.31 | v11.9,8.2 11.9,9.1 14.3,11.2 v14.3,11.6 14.3,11.3 | v18.3,31.5 18.3,32.99 R13.1
  Bottom 0.254: v4.4,10.6 6.9,8.2 v11.9,8.2 v15.2,8.2 | v14.3,11.6 12.7,11.6 7.9,16.4 7.9,18.6 6.8,19.7 6.8,25.8 11.3,30.3 11.3,31.81 15.57,36.08 17.73,36.08 18.87,34.94 18.87,33.57 18.3,32.99 v18.3,31.5
R_MOSI  (via drill 0.6 pad 0.25)
  Top 0.254: U1.24 7.11,10.89 6.2,11.8 4.3,11.8 v2.7,10.2 2.7,9.46 U1.32 | IC1.20 19.79,9.5 | 19.79,9.5 v16.8,9.5 | 19.79,9.5 19.79,10.19 v20,10.4 | v17.6,33.7 18.4,34.5 R12.1
  Bottom 0.254: v16.8,9.5 6.9,9.5 5,11.4 3.9,11.4 v2.7,10.2 | v20,10.4 19.1,11.3 15.7,11.3 14.9,12.2 14.7,12.4 12.7,12.4 8.4,16.7 8.4,18.8 7.3,19.9 7.3,25.6 11.8,30.1 11.8,31.7 15.69,35.59 17.61,35.59 18.02,35.18 18.02,34.12 v17.6,33.7
R_SCLK  (via drill 0.6 pad 0.25)
  Top 0.254: U1.26 5.89,10.51 6.5,9.9 6.9,9.9 10.3,6.5 10.3,6.14 U1.11 10.87,5.63 11.3,5.2 12.1,5.2 12.8,6.1 v12.8,6.6 | IC1.1 19.13,8.4 v16.6,8.4 15.6,9.4 15.6,10 17.8,12.2 v17.8,16.12 | v24,24.2 24,29.5 25.1,30.6 v25.1,34.9 | v22.7,37.3 19.6,37.3 19.3,37 19.3,35.99 R14.1
  Bottom 0.254: v12.8,6.6 14.8,6.6 v16.6,8.4 | v25.1,34.9 v22.7,37.3 | v17.8,16.12 17.8,19.5 20.4,22.1 21.9,22.1 v24,24.2
R_VCC  (via drill 0.6 pad 0.25)
  Top 0.254: IC1.4 IC1.5 18.9,5.31 v18.9,4.4 | C8.2 C9.2 23.1,2.9 v22.4,3.6 21.94,4.06 IC1.9 | IC1.18 21.44,10.75 C10.2 22.29,12.39 22.28,12.4 22.28,12.98 | IC1.11 24.23,5.97 v24.6,5.6 | IC1.14 IC1.15 23.37,7.97 v24.4,9 | v23.2,13.9 22.28,12.98 | 22.28,12.98 U$1.6 | U$2.6 15.95,32.09 v15.95,31.23
  Bottom 0.254: IC1.11 22.4,5.05 v22.4,3.6 21.6,4.4 v18.9,4.4 | IC1.11 24.23,5.97 v24.6,5.6 | IC1.11 23.32,7.92 v24.4,9 v24.4,12.2 23.2,13.4 v23.2,13.9 23.2,15.67 21.74,17.13 19.7,17.13 18.94,16.37 18.94,15.35 18.25,14.67 16.97,14.67 13.66,17.97 13.66,27.71 15.95,30 v15.95,31.23
  pour Top: 25,0 25.2,15.1 16,15 16,0
SA_BSL_RST
  Top 0.254: U1.9 10.8,4.2 13,4.2 14.3,5.5 14.3,7.3 13.6,8 13.6,8.9 16.9,12.2 16.9,16.65 17.98,17.73 19.33,17.73 19.6,18 24.9,18 25.7,18.8 R8.1
SA_BSL_RX  (via drill 0.6 pad 0.3)
  Top 0.254: v19.8,19.9 18.1,19.9 15.1,16.9 15.1,14.6 11,10.5 9,10.5 U1.21 | v38.6,23.1 37.91,22.31 R11.1 | U1.21
  Bottom 0.254: v38.6,23.1 33.1,23.1 27.4,17.4 22.9,17.4 20.4,19.9 v19.8,19.9
SA_BSL_TEST
  Top 0.254: U1.10 11.02,4.7 12.4,4.7 13.7,6 13.7,7.1 13.1,7.7 13.1,9.2 16.3,12.4 16.3,16.78 17.78,18.26 19.16,18.26 19.4,18.5 23.49,18.5 R9.1
SA_BSL_TX  (via drill 0.6 pad 0.3)
  Top 0.254: v37.5,21.3 37.2,21.3 37.2,20.8 36.61,20.21 R10.1 | U1.20 8.69,9.49 9.2,10 11.2,10 15.6,14.4 15.6,16.73 17.97,19.1 v18.7,19.1
  Bottom 0.254: v18.7,19.1 20.4,19.1 22.6,16.9 27.5,16.9 31.9,21.3 v37.5,21.3
SA_CS  (via drill 0.6 pad 0.25, 0.6 pad 0.3)
  Top 0.254: U1.7 9.9,3.7 15.4,3.7 15.7,4 15.7,5.4 v15.3,5.8 | U3.3 4.77,22.67 5.5,23.4 11.63,23.4 13.09,21.93 15.46,21.93 15.71,21.68 15.71,19.01 14.1,17.4 14.1,15.8 12,13.7 11.1,13.7 v10.3,12.9
  Bottom 0.254: v15.3,5.8 15.3,6.3 16.6,7.6 17.1,7.6 17.6,8.1 17.6,9.8 17.1,10.3 11.6,10.3 10.3,11.6 v10.3,12.9
SA_R_VCC_SEL  (via drill 0.6 pad 0.25)
  Top 0.254: U1.38 2.15,5.08 2.15,4.41 4.03,2.53 v4.03,2.5 | v32.21,19.76 31.15,19.76 v29.87,21.04 | U$2.2 14.81,35.97 16.68,37.83 v17.5,37.83
  Bottom 0.254: v4.03,2.5 5.94,0.58 25.38,0.58 27.46,2.67 27.46,10.43 27.83,10.79 27.83,15.77 31.81,19.76 v32.21,19.76 | v29.87,21.04 29.93,21.04 31.41,22.52 31.41,24.37 21.02,34.76 21.04,34.78 21.04,35.27 18.48,37.83 v17.5,37.83
SA_RST  (via drill 0.6 pad 0.3)
  Top 0.254: U1.23 8.1,11.04 v8.1,11.6 | R4.2 | R4.2 7.61,16 C2.2 7.6,17.9 5.5,20 2.7,20 2.6,20.1 1.8,20.1 1.4,19.7 1.4,18.3 J1.1 | v9.1,14.1 9.1,15.4 8.6,15.9 R4.2
  Bottom 0.254: v8.1,11.6 8.1,13.1 v9.1,14.1
SA_T_R_VCC_ENA  (via drill 0.6 pad 0.25)
  Top 0.254: U$1.5 21.05,11.65 v20.8,11.4 | v16.7,3 16.7,2.9 16.4,2.6 9.56,2.6 U1.5
  Bottom 0.254: v16.7,3 17.5,3.8 17.5,5.1 20.1,7.7 20.1,8.6 20.8,9.3 v20.8,11.4
SA_T_VCC_SEL  (via drill 0.6 pad 0.25)
  Top 0.254: U1.4 9.38,2.1 17.1,2.1 17.5,2.5 17.5,5.8 v17.2,6.1 | v18.8,10.4 v18.8,14 | U$2.5 14.8,32.57 14.8,31.73 14.5,31.43 v14.34,31.43
  Bottom 0.254: v17.2,6.1 18.8,7.7 v18.8,10.4 | v18.8,14 13.4,14 10,17.4 10,19.4 8.9,20.5 8.9,24.1 11.4,26.6 11.4,28.3 12.8,29.7 12.8,30.72 13.51,31.43 v14.34,31.43
SA_TEST
  Top 0.254: U1.22 9.1,11.32 9.1,11.8 8.3,12.6 6.3,12.6 3.71,15.19 J1.6
SA_VCC  (via drill 0.6 pad 0.25, 0.6 pad 0.3)  (1 unrouted)
  Top 0.254: U3.5 2.43,25.84 R1.2 3.29,27.75 U2.3 3.44,27.9 v5.2,27.9 5.2,27.55 C1.2 | J1.4 4.67,15.02 D1.P$2 | D1.P$2 7.59,15.02 R4.1 | D1.P$2 6.52,14.42 v6.1,14 | v2.7,12.9 2,12.2
  Bottom 0.254: v5.2,27.9 5.2,18.8 6.3,17.7 6.3,14.2 v6.1,14 5,12.9 v2.7,12.9
  pour Top: 15,0 15,10 10,15 0,15 0,4 4,0
SA_VS  (via drill 0.6 pad 0.25, 0.6 pad 0.3)
  Top 0.254: U1.6 9.68,3.2 15.8,3.2 16.5,3.9 v16.5,5 | 7.01,24.5 R2.1 R3.1 8,24.1 8.2,23.9 13.08,23.9 14.58,22.4 15.68,22.4 16.24,21.84 16.24,18.84 14.6,17.2 14.6,15.3 v11.2,11.9
  Bottom 0.254: v16.5,5 16.3,5.2 16.3,6.5 16.8,7.1 17.3,7.1 18.1,7.9 18.1,9.9 17.2,10.8 12.3,10.8 v11.2,11.9
T_BSL_RST  (via drill 0.6 pad 0.25)
  Top 0.254: MSP1.29 25.37,20.94 R8.2 27.21,20.61 28.36,19.46 29.34,19.46 31,17.8 v31.9,17.8 C3.2 R5.2 | 38.02,14.48 J2.1 | 38.02,14.69 J2.1 | J2.1 38.82,14.72 v39.1,15
  Bottom 0.254: v39.1,15 38.5,15.6 35.3,15.6 33.1,17.8 v31.9,17.8
T_BSL_RX
  Top 0.254: MSP1.51 37.49,23.42 R11.2
T_BSL_TEST  (via drill 0.6 pad 0.3)
  Top 0.254: R9.2 24.87,20.88 MSP1.28 | MSP1.28 24.87,20.77 24.6,20.5 | J2.6 37.4,17.71 37.4,19.2 37,19.6 35.7,19.6 35.1,19 30.77,19 29.16,20.61 28.64,20.61 v28.61,20.58 | v27.1,24.2 25.5,24.2 24.9,23.6 24.9,22.56 MSP1.28
  Bottom 0.254: v28.61,20.58 28.61,22.69 v27.1,24.2
T_BSL_TX
  Top 0.254: R10.2 35.86,21.75 MSP1.50
T_R_CSN
  Top 0.254: R15.2 34.87,21.34 MSP1.48
T_R_GDO0
  Top 0.254: MSP1.14 21.05,29.64 R16.2
T_R_GDO2
  Top 0.254: MSP1.15 19.94,29.16 19.5,29.6 R17.2
T_R_MISO
  Top 0.254: MSP1.5 21.04,34.14 20.5,33.6 R13.2
T_R_MOSI
  Top 0.254: MSP1.4 22.2,34.6 20.01,34.6 R12.2
T_R_SCLK
  Top 0.254: MSP1.2 22.19,35.6 20.51,35.6 R14.2
T_R_VCC_SEL  (via drill 0.6 pad 0.25)
  Top 0.254: U$1.2 v21.05,16.12 v21.06,16.13 | MSP1.3 17.22,35.15 v16.68,34.61
  Bottom 0.254: v21.06,16.13 21.06,14.56 19.2,12.7 15.8,12.7 15.1,13.4 13.1,13.4 9.4,17.1 9.4,19.2 8.3,20.3 8.3,24.7 9.5,25.9 10.1,25.9 10.8,26.6 10.8,28.4 12.3,29.9 12.3,31.6 15.31,34.61 v16.68,34.61
T_VCC  (via drill 0.6 pad 0.25, 0.6 pad 0.3)
  Top 0.254: v23.2,19.6 23,19.6 22.7,19.9 | MSP1.58 35.94,27.66 34.2,29.4 29.5,29.4 v26.5,26.4 | J2.4 36.31,15.56 D2.P$2 34.05,15.56 R5.1 32.39,15.71 29.11,18.99 27.89,18.99 27.08,19.8 v26.7,19.8 | U$2.3 14.16,37.02 16.05,38.91
  Bottom 0.254: v26.7,19.8 23.4,19.8 v23.2,19.6 23.8,20.2 23.8,22.5 26.5,25.2 v26.5,26.4
  pour Top: 40,15.9 15.1,16 15,40 36,40 40,36
VDD  (via drill 0.6 pad 0.25, 0.6 pad 0.3)
  Top 0.254: J1.2 4,18.5 v4,19.2 | v17.9,21.1 v21.1,21.1 | v4,20.8 14.6,20.8 v14.9,21.1 | J2.2 32.68,14.72 28.9,18.5 v27,18.5
  Bottom 0.254: v21.1,21.1 21.1,20 22.6,18.5 v27,18.5 | v14.9,21.1 v17.9,21.1 | v4,19.2 v4,20.8
VSS(GND)  (via drill 0.6 pad 0.25)
  Top 0.254: J1.3 0.9,17.62 v0.9,21.7 | v39,16.4 38.69,15.99 J2.3
  Bottom 0.254: v0.9,21.7 3.2,24 3.2,27.3 14.58,38.68 18.15,38.68 18.45,38.99 19.95,38.99 20.44,38.5 23.8,38.5 24.31,38.5 35.6,38.5 39.4,34.7 39.4,17 39,16.6 v39,16.4

### Text on the board
bPlace: Shoulder Angel / Version: 2a | Clemson University / Connor Bolton / 02/2016